# Altium schematic sheet Sheet1.SchDoc: STM32 Radiofrequency Adapter
size A4; DrawnBy: Bruno Alexandre Fraga; Revision: 1.0.0; SheetNumber: 1; SheetTotal: 1; Number: 2025.01
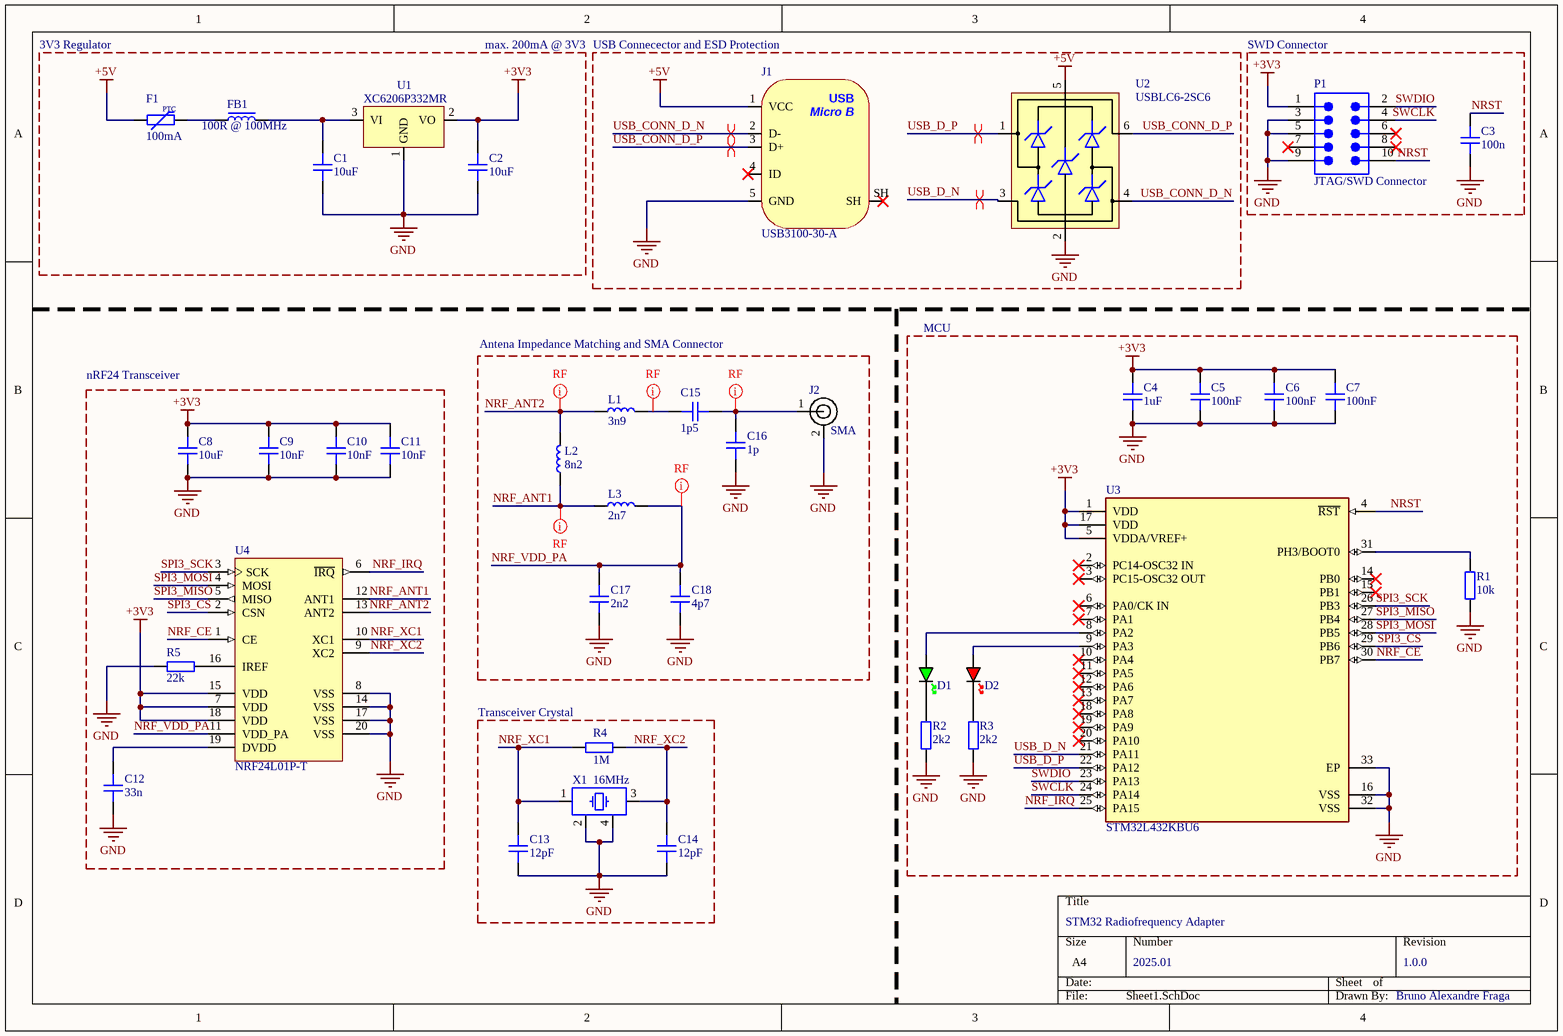
[diagram p0: Sheet1.SchDoc]

## Parts
C1  10uF  [CAP_0603]
C2  10uF  [CAP_0603]
C3  100n  [CAP_0402]
C4  1uF  [CAP_0402]
C5  100nF  [CAP_0402]
C6  100nF  [CAP_0402]
C7  100nF  [CAP_0402]
C8  10uF  [CAP_0402]
C9  10nF  [CAP_0402]
C10  10nF  [CAP_0402]
C11  10nF  [CAP_0402]
C12  33n  [CAP_0402]
C13  12pF  [CAP_0402]
C14  12pF  [CAP_0402]
C15  1p5  [CAP_0402]
C16  1p  [CAP_0402]
C17  2n2  [CAP_0402]
C18  4p7  [CAP_0402]
D1  GREEN  [LED_0402_GREEN]  (value not drawn)
D2  RED  [LED_0402_RED]  (value not drawn)
F1  100mA  [FUSE_1206]
FB1  100R @ 100MHz  [FB_0805]
J1  USB3100-30-A  [USB3100-30-A]
J2  SMA  [73251-1150]
L1  3n9  [IND_0402]
L2  8n2  [IND_0402]
L3  2n7  [IND_0402]
P1  JTAG/SWD Connector  [61201021621]
R1  10k  [RES_0402]
R2  2k2  [RES_0603]
R3  2k2  [RES_0603]
R4  1M  [RES_0402]
R5  22k  [RES_0402]
U1  XC6206P332MR  [SOT95P240X115-3N]
U2  USBLC6-2SC6  [SOT-23-6]
U3  STM32L432KBU6  [FP-UFQFPN32-A0B8-MFG]
U4  NRF24L01P-T  [NRSC-QFN-20_L]
X1  16MHz  [XTAL_2016]

## Blocks framed on the sheet
USB Connecector and ESD Protection: J1 U2
SWD Connector: C3 P1
MCU: C4-C7 D1 D2 R1-R3 U3
nRF24 Transceiver: C8-C12 R5 U4
Antena Impedance Matching and SMA Connector: C15-C18 J2 L1-L3
Transceiver Crystal: C13 C14 R4 X1

## Nets
+3V3: C2.1 C4.2 C5.2 C6.2 C7.2 C8.2 C9.2 C10.2 C11.2 P1.1 U1.2(VO) U3.1(VDD) U3.5(VDDA/VREF+) U3.17(VDD) U4.7(VDD) U4.15(VDD) U4.18(VDD)
+5V: F1.1 J1.1(VCC) U2.5(VBUS)
GND: C1.2 C2.2 C3.1 C4.1 C5.1 C6.1 C7.1 C8.1 C9.1 C10.1 C11.1 C12.1 C13.1 C14.1 C16.1 C17.1 C18.1 J1.5(GND) J2.2 P1.3 P1.5 P1.9 R1.1 R2.1 R3.1 R5.2 U1.1(GND) U2.2(GND) U3.16(VSS) U3.32(VSS) U3.33(EP) U4.8(VSS) U4.14(VSS) U4.17(VSS) U4.20(VSS) X1.2 X1.4
NRF_ANT1: L2.1 L3.1 U4.12(ANT1)
NRF_ANT2: L1.1 L2.2 U4.13(ANT2)
NRF_CE: U3.30(PB7) U4.1(CE)
NRF_IRQ: U3.25(PA15) U4.6(~{IRQ})
NRF_VDD_PA: C17.2 C18.2 L3.2 U4.11(VDD_PA)
NRF_XC1: C13.2 R4.1 U4.10(XC1) X1.1
NRF_XC2: C14.2 R4.2 U4.9(XC2) X1.3
NRST: C3.2 P1.10 U3.4(~{RST})
SPI3_CS: U3.29(PB6) U4.2(CSN)
SPI3_MISO: U3.27(PB4) U4.5(MISO)
SPI3_MOSI: U3.28(PB5) U4.4(MOSI)
SPI3_SCK: U3.26(PB3) U4.3(SCK)
SWCLK: P1.4 U3.24(PA14)
SWDIO: P1.2 U3.23(PA13)
USB_CONN_D_N: J1.2(D-) U2.4(IO2)
USB_CONN_D_P: J1.3(D+) U2.6(IO1)
USB_D_N: U2.3(IO2) U3.21(PA11)
USB_D_P: U2.1(IO1) U3.22(PA12)
NetC1_1: C1.1 FB1.2 U1.3(VI)
NetC12_2: C12.2 U4.19(DVDD)
NetC15_1: C15.1 L1.2
NetC15_2: C15.2 C16.2 J2.1
NetD1_A: D1.A U3.8(PA2)
NetD1_K: D1.K R2.2
NetD2_A: D2.A U3.9(PA3)
NetD2_K: D2.K R3.2
NetF1_2: F1.2 FB1.1
NetR1_2: R1.2 U3.31(PH3/BOOT0)
NetR5_1: R5.1 U4.16(IREF)

Not connected (* = marked no-connect by the designer): J1 4(ID)* SH*; P1 6* 7* 8*; U3 2(PC14-OSC32_IN)* 3(PC15-OSC32_OUT)* 6(PA0/CK_IN)* 7(PA1)* 10(PA4)* 11(PA5)* 12(PA6)* 13(PA7)* 14(PB0)* 15(PB1)* 18(PA8)* 19(PA9)* 20(PA10)*

## Layout directives
differential pair: USB_CONN_D_N, USB_CONN_D_P, USB_D_N, USB_D_P
net class RF: NetC15_1, NetC15_2, NRF_ANT1, NRF_ANT2, NRF_VDD_PA

## Notes on the sheet
- 3V3 Regulator
- max. 200mA @ 3V3
- (in symbol FUSE_PPTC_1206) PTC
- (in symbol USB3100-30-A) USB; Micro B

## Library data of the parts
C1 C2 = CAP_0603: Capacitor SMD 0603; Manufacturer: *; Manufacturer Part Number: *; Distributor Link: *; LCSC: *; Rating: *; Dielectric: *
C3-C18 = CAP_0402: Capacitor SMD 0402; Manufacturer: *; Manufacturer Part Number: *; Distributor Link: *; LCSC: *; Rating: *; Dielectric: *
D1 = LED_0402_GREEN: LED 0402 GREEN SMD
D2 = LED_0402_RED: LED 0402 RED SMD
F1 = FUSE_PPTC_1206: Fuse PPTC SMD 1206; Manufacturer: *; Manufacturer Part Number: *
FB1 = FB_0805: Ferrite Bead SMD 0805; Manufacturer: *; Manufacturer Part Number: *; Distributor Link: *; LCSC: *
J1 = USB3100-30-A: USB Connector Type Micro B 2.0 SMD Reverse Mount; Manufacturer: GCT; Manufacturer Part Number: USB3100-30-A
J2 = 73251-1150: RF Connector 50 Ohms, SMA Jack Receptacle, Edge Mount, .25µm Gold (Au) Plating; Manufacturer: Molex; Manufacturer Part Number: 73251-1150
L1-L3 = IND_0402: Inductor SMD 0402
P1 = CON-JTAG-Box: Board Connector, 10 Contact(s), 2 Row(s), Male, Straight, 0.1 inch Pitch, Solder Terminal, Black Insulator, Plug; NexarPartId: 8917783; Number of Contacts: 10; Voltage Rating (DC): 250V; Insulation Resistance: 1GΩ; Current Rating: 3A; Row Spacing: 2.54mm; Contact Resistance: 20mΩ; Connector Type: Male Pin; Flammability Rating: UL94 V-0; Termination: Solder; Width: 20.36mm; Length: 20.36mm; Housing Material: PBT; Operating Supply Voltage: 250V; Min Operating Temperature: -40°C; Lead Free: Lead Free; Insulation Material: PBT; Orientation: Vertical; RoHS: Compliant; Voltage Rating: 250V; Number of Pins: 10; Height: 8.85mm; REACH SVHC: Unknown; Contact Material: Copper; Contact Gender: Male; Color: Black; Gender: Male; Mount: Through Hole; Contact Plating: Gold; Lead Pitch: 2.54mm; Number of Positions: 10; Pitch: 2.54mm; Max Operating Temperature: 105°C; Number of Rows: 2
R1 R4 R5 = RES_0402: Resistor SMD 0402; Manufacturer: *; Manufacturer Part Number: *; Distributor Link: *; LCSC: *
R2 R3 = RES_0603: Resistor SMD 0603; Manufacturer: *; Manufacturer Part Number: *; Distributor Link: *; LCSC: *
U1 = XC6206P332MR: Linear voltage regulator 250mA; / Output voltage: 1.5V~5.0V (step size 0.1V).
U2 = USBLC6-2SC6: Low-Capacitance ESD Protection USB; Manufacturer: STMicroelectronics; Manufacturer Part Number: USBLC6-2SC6; Distributor Link: https://www.mouser.de/ProductDetail/STMicroelectronics/USBLC6-2SC6?qs=po45yt2pPpu%2FhNIlwQdTlg%3D%3D
U3 = STM32L432KBU6: Ultra-low-power Arm Cortex-M4 32-bit MCU+FPU, 100DMIPS, up to 256KB Flash, 64KB SRAM, USB FS, analog, audio.; Manufacturer: STMicroelectronics; Memory Size: 128KBytes; Number Of I/Os: 26; Max Supply Voltage: 3.6V; Number Of A/D Converters: 1; Number Of Timers/Counters: 8; Min Supply Voltage: 1.62V; Interface: I2C,SPI,UART,USART,USB,IrDA; Number Of Spi Channels: 2; Frequency: 80MHz; Max Junction Temp: +105°C; Number Of Adc Channels: 10; Ram Size: 64KBytes; Data Bus Width: 32bits; Ambient Temperature Range High: +85°C; Device Class L2: Embedded Processors and Controllers; Temperature: -40°C to +85°C; Core Architecture: ARM Cortex-M4; Category: IC; ComponentLink2URL: https://www.st.com/resource/en/datasheet/stm32l432kb.pdf; Device Class L1: Integrated Circuits (ICs); ComponentLink2Description: Datasheet; Memory Type: FLASH; Ipc Land Pattern Name: QFN50P500X500X55-32; Temperature Range Low: -40°C; Height: 0.6mm; Digikey Description: IC MCU 32BIT 128KB FLASH 32QFPN; Temperature Range High: +85°C; Device Class L3: Microcontrollers; Lead Free: Yes; RoHS: TRUE; Octopart: https://octopart.com/stm32l432kbu6-stmicroelectronics-74568735; Manufacturer Part Number: STM32L432KBU6; Number Of Uart Channels: 1; Ambient Temperature Range Low: -40°C; Package: UFQFPN32-A0B8; Number Of I2C Channels: 2; Number Of Cores: 1; Automotive: No
U4 = nRF24L01: Single Chip Transceiver, 2.4 GHz, 60 mW, 1.9 to 3.6 V, -40 to 85 degC, 20-Pin QFN, RoHS, Tray; Manufacturer: Nordic Semiconductor; Data Rate (Max): 2Mbps; Current - Transmitting: 7mA~11.3mA; Power - Output: 0dBm; Other Names: 1490-1019; Online Catalog: nRF24L01+; Current - Receiving: 12.6mA~13.5mA; For Use With: 1490-1002-ND-KITEVALUATIONNRF24L01P1568-1295-ND-SPARKFUNTRANSCEIVERBREAKOUT-1568-1296-ND-SPARKFUNTRANSCEIVERBREAKOUT-1471-1410-ND-DEVBOARDNRFSCLICKNRF24L01P-MODULE-PCB-ND-KITEVALNRF24L01+PCBANTENNANRF24L01P-MODULE-SMA-ND-KITEVALNRF24L01+SMACONNNRF24L01P-UPGRADE-ND-UPGRADE2PCB/1SMANRF24L01103990038-ND-DEVDUINOSENSORNODEV1.3103990053-ND-DEVDUINOSENSORNODEV2(ATMEGA103990074-ND-DEVDUINOSENSORNODE106990026-ND-ENERGYMONITORSHIELDV2113990088-ND-WIRELESSGATESHIELD113990095-ND-DEVDUINOSENSORNODEV3(ATMEGA106030001-ND-ENERGYMONITORSHIELD1597-1361-ND-DEVDUINOSENSORNODEV2.2(ATMEG105990030-ND-RGBWSTRIPWIRELESSSHIELDV1.0; Frequency: 2.4GHz; Design Resources: DevelopmentToolSelector; RF Family/Standard: GeneralISM>1GHZ; Serial Interfaces: SPI; Sensitivity: -94dBm; Voltage - Supply: 1.9V~3.6V; Modulation: GFSK; GPIO: -; Package Reference: QFN20; Memory Size: -; Category: RF/IFandRFID; Type: TxRxOnly; Standard Package: 490; Package / Case: 20-VFQFNExposedPad; Packaging: Tray; Series: -; Package Description: 20-Pin Quad Flat No-lead Package, Body 4 x 4 mm, Pitch 0.5 mm; Datasheet Version: Rev. 1.0, 09/2008; Protocol: -; Manufacturer URL: http://www.nordicsemi.com/eng/Products/; Operating Temperature: -40°C~85°C; Family: RFTransceiverICs; Datasheet URL: http://www.nordicsemi.com/eng/content/download/2726/34069/file/nRF24L01P_Product_Specification_1_0.pdf; Mounting Technology: SurfaceMount
X1 = XTAL_2016: Crystal SMD 4-Pin 2.0x1.6mm; Distributor Link: *